# Altium schematic sheet 10_Connectors.SchDoc
size 420 x 297 mm; DocumentNumber: 15EDGVC-3.5-10P; SheetNumber: 10; SheetTotal: 11
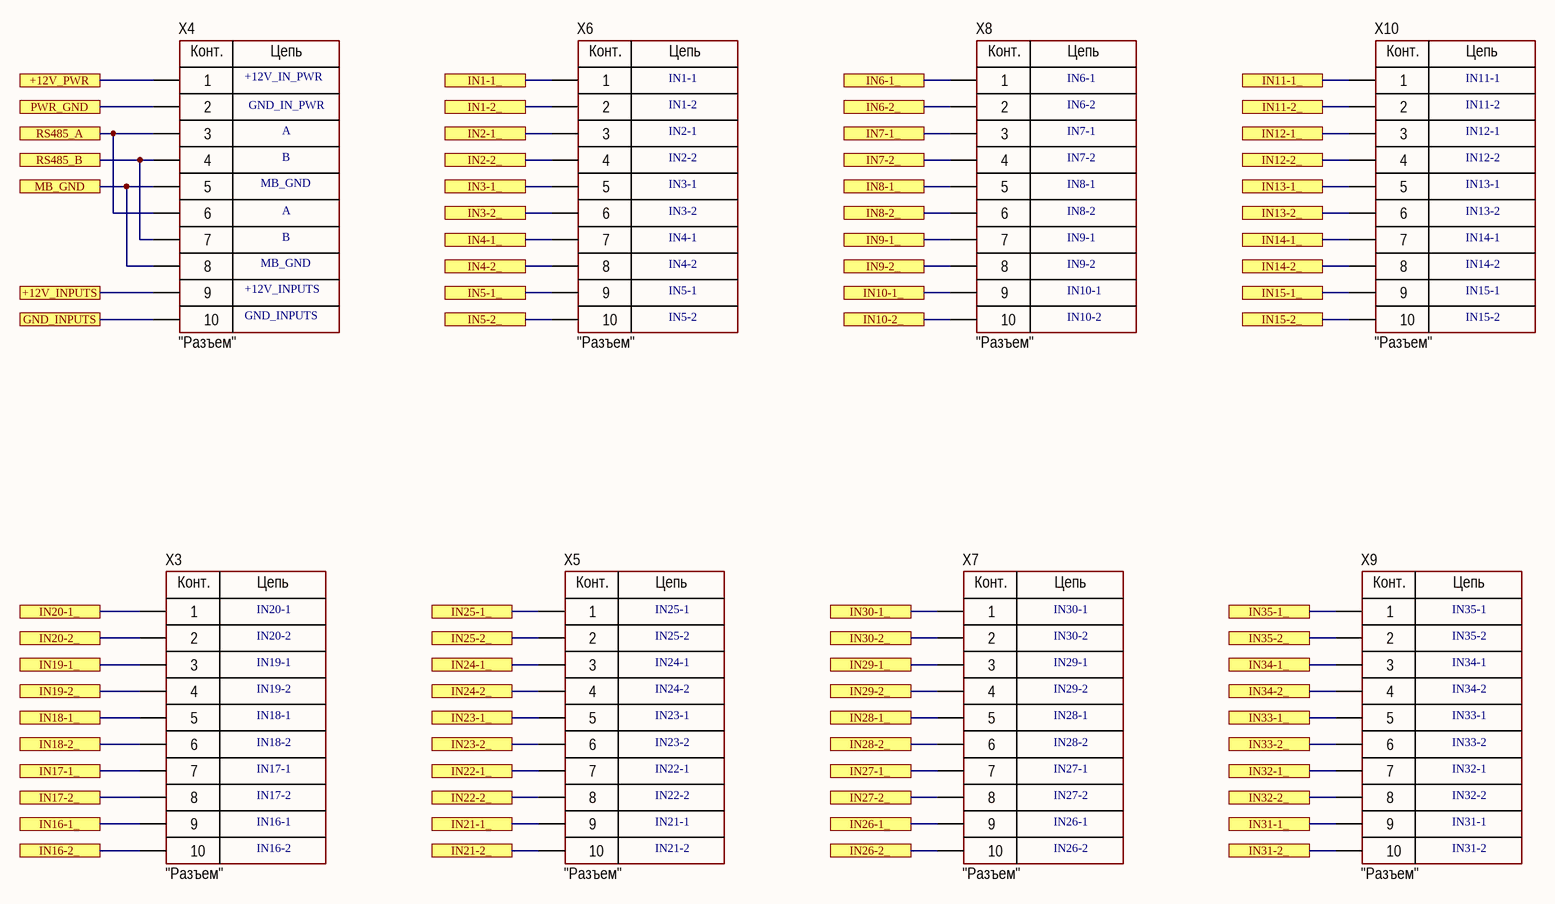
[diagram p0: 10_Connectors.SchDoc]

## Parts
X3  CommentText: "Разъем"  [CON: 15EDGVC-3.5-10P-14-00AH]
X4  CommentText: "Разъем"  [CON: 15EDGVC-3.5-10P-14-00AH]
X5  CommentText: "Разъем"  [CON: 15EDGVC-3.5-10P-14-00AH]
X6  CommentText: "Разъем"  [CON: 15EDGVC-3.5-10P-14-00AH]
X7  CommentText: "Разъем"  [CON: 15EDGVC-3.5-10P-14-00AH]
X8  CommentText: "Разъем"  [CON: 15EDGVC-3.5-10P-14-00AH]
X9  CommentText: "Разъем"  [CON: 15EDGVC-3.5-10P-14-00AH]
X10  CommentText: "Разъем"  [CON: 15EDGVC-3.5-10P-14-00AH]

## Ports
+12V_INPUTS, +12V_PWR, GND_INPUTS, IN1-1_, IN1-2_, IN2-1_, IN2-2_, IN3-1_, IN3-2_, IN4-1_, IN4-2_, IN5-1_, IN5-2_, IN6-1_, IN6-2_, IN7-1_, IN7-2_, IN8-1_, IN8-2_, IN9-1_, IN9-2_, IN10-1_, IN10-2_, IN11-1_, IN11-2_, IN12-1_, IN12-2_, IN13-1_, IN13-2_, IN14-1_, IN14-2_, IN15-1_, IN15-2_, IN16-1_, IN16-2_, IN17-1_, IN17-2_, IN18-1_, IN18-2_, IN19-1_, IN19-2_, IN20-1_, IN20-2_, IN21-1_, IN21-2_, IN22-1_, IN22-2_, IN23-1_, IN23-2_, IN24-1_, IN24-2_, IN25-1_, IN25-2_, IN26-1_, IN26-2_, IN27-1_, IN27-2_, IN28-1_, IN28-2_, IN29-1_, IN29-2_, IN30-1_, IN30-2_, IN31-1_, IN31-2_, IN32-1_, IN32-2_, IN33-1_, IN33-2_, IN34-1_, IN34-2_, IN35-1_, IN35-2_, MB_GND, PWR_GND, RS485_A, RS485_B

## Nets
+12V_INPUTS: X4.9 ; port +12V_INPUTS
+12V_PWR: X4.1 ; port +12V_PWR
GND_INPUTS: X4.10 ; port GND_INPUTS
IN1-1_: X6.1 ; port IN1-1_
IN1-2_: X6.2 ; port IN1-2_
IN2-1_: X6.3 ; port IN2-1_
IN2-2_: X6.4 ; port IN2-2_
IN3-1_: X6.5 ; port IN3-1_
IN3-2_: X6.6 ; port IN3-2_
IN4-1_: X6.7 ; port IN4-1_
IN4-2_: X6.8 ; port IN4-2_
IN5-1_: X6.9 ; port IN5-1_
IN5-2_: X6.10 ; port IN5-2_
IN6-1_: X8.1 ; port IN6-1_
IN6-2_: X8.2 ; port IN6-2_
IN7-1_: X8.3 ; port IN7-1_
IN7-2_: X8.4 ; port IN7-2_
IN8-1_: X8.5 ; port IN8-1_
IN8-2_: X8.6 ; port IN8-2_
IN9-1_: X8.7 ; port IN9-1_
IN9-2_: X8.8 ; port IN9-2_
IN10-1_: X8.9 ; port IN10-1_
IN10-2_: X8.10 ; port IN10-2_
IN11-1_: X10.1 ; port IN11-1_
IN11-2_: X10.2 ; port IN11-2_
IN12-1_: X10.3 ; port IN12-1_
IN12-2_: X10.4 ; port IN12-2_
IN13-1_: X10.5 ; port IN13-1_
IN13-2_: X10.6 ; port IN13-2_
IN14-1_: X10.7 ; port IN14-1_
IN14-2_: X10.8 ; port IN14-2_
IN15-1_: X10.9 ; port IN15-1_
IN15-2_: X10.10 ; port IN15-2_
IN16-1_: X3.9 ; port IN16-1_
IN16-2_: X3.10 ; port IN16-2_
IN17-1_: X3.7 ; port IN17-1_
IN17-2_: X3.8 ; port IN17-2_
IN18-1_: X3.5 ; port IN18-1_
IN18-2_: X3.6 ; port IN18-2_
IN19-1_: X3.3 ; port IN19-1_
IN19-2_: X3.4 ; port IN19-2_
IN20-1_: X3.1 ; port IN20-1_
IN20-2_: X3.2 ; port IN20-2_
IN21-1_: X5.9 ; port IN21-1_
IN21-2_: X5.10 ; port IN21-2_
IN22-1_: X5.7 ; port IN22-1_
IN22-2_: X5.8 ; port IN22-2_
IN23-1_: X5.5 ; port IN23-1_
IN23-2_: X5.6 ; port IN23-2_
IN24-1_: X5.3 ; port IN24-1_
IN24-2_: X5.4 ; port IN24-2_
IN25-1_: X5.1 ; port IN25-1_
IN25-2_: X5.2 ; port IN25-2_
IN26-1_: X7.9 ; port IN26-1_
IN26-2_: X7.10 ; port IN26-2_
IN27-1_: X7.7 ; port IN27-1_
IN27-2_: X7.8 ; port IN27-2_
IN28-1_: X7.5 ; port IN28-1_
IN28-2_: X7.6 ; port IN28-2_
IN29-1_: X7.3 ; port IN29-1_
IN29-2_: X7.4 ; port IN29-2_
IN30-1_: X7.1 ; port IN30-1_
IN30-2_: X7.2 ; port IN30-2_
IN31-1_: X9.9 ; port IN31-1_
IN31-2_: X9.10 ; port IN31-2_
IN32-1_: X9.7 ; port IN32-1_
IN32-2_: X9.8 ; port IN32-2_
IN33-1_: X9.5 ; port IN33-1_
IN33-2_: X9.6 ; port IN33-2_
IN34-1_: X9.3 ; port IN34-1_
IN34-2_: X9.4 ; port IN34-2_
IN35-1_: X9.1 ; port IN35-1_
IN35-2_: X9.2 ; port IN35-2_
MB_GND: X4.5 X4.8 ; port MB_GND
PWR_GND: X4.2 ; port PWR_GND
RS485_A: X4.3 X4.6 ; port RS485_A
RS485_B: X4.4 X4.7 ; port RS485_B

## Notes on the sheet
- +12V_IN_PWR
- GND_IN_PWR
- IN1-1
- IN1-2
- IN6-1
- IN6-2
- IN11-1
- IN11-2
- A
- B
- IN2-1
- IN2-2
- IN7-1
- IN7-2
- IN12-1
- IN12-2
- MB_GND
- IN3-1
- IN3-2
- IN4-1
- IN8-1
- IN8-2
- IN9-1
- IN13-1
- IN13-2
- IN14-1
- +12V_INPUTS
- GND_INPUTS
- IN4-2
- IN5-1
- IN9-2
- IN10-1
- IN14-2
- IN15-1
- IN5-2
- IN10-2
- IN15-2
- IN20-1
- IN20-2
- IN25-1
- IN25-2
- IN30-1
- IN30-2
- IN35-1
- IN35-2
- IN18-1
- IN19-1
- IN19-2
- IN23-1
- IN24-1
- IN24-2
- IN28-1
- IN29-1
- IN29-2
- IN33-1
- IN34-1
- IN34-2
- IN17-1
- IN18-2
- IN22-1
- IN23-2
- IN27-1
- IN28-2
- IN32-1
- IN33-2
- IN16-1
- IN16-2
- IN17-2
- IN21-1
- IN21-2
- IN22-2
- IN26-1
- IN26-2
- IN27-2
- IN31-1
- IN31-2
- IN32-2
- Подп. и дата
- Инв. № дубл.
- Взам. инв. №
- Инв. № подл.
- Изм.
- Лист
- № докум.
- Подп.
- Дата
- 2.106-A3
- Копировал
- Формат А3
- (in symbol 15EDGVC-3.5-10P-14-00A(H)) Конт.; Цепь

## Library data of the parts
X3-X10 = 15EDGVC-3.5-10P-14-00A(H): Manufacturer: Degson; ValueManufacturerPartNumber: Terminal connector, 6pin, 3.5mm, 300VAC, 10A; TypeConnector: Terminal connector; VoltageMax: 300VAC; Pitch: 3.5mm; CurrentMax: 10A; Multichannel: 6pin; PartNumber: 15EDGVC-3.5-10P-14-00A(H)